# Altium schematic sheet 6PCB.SchDoc
size A4
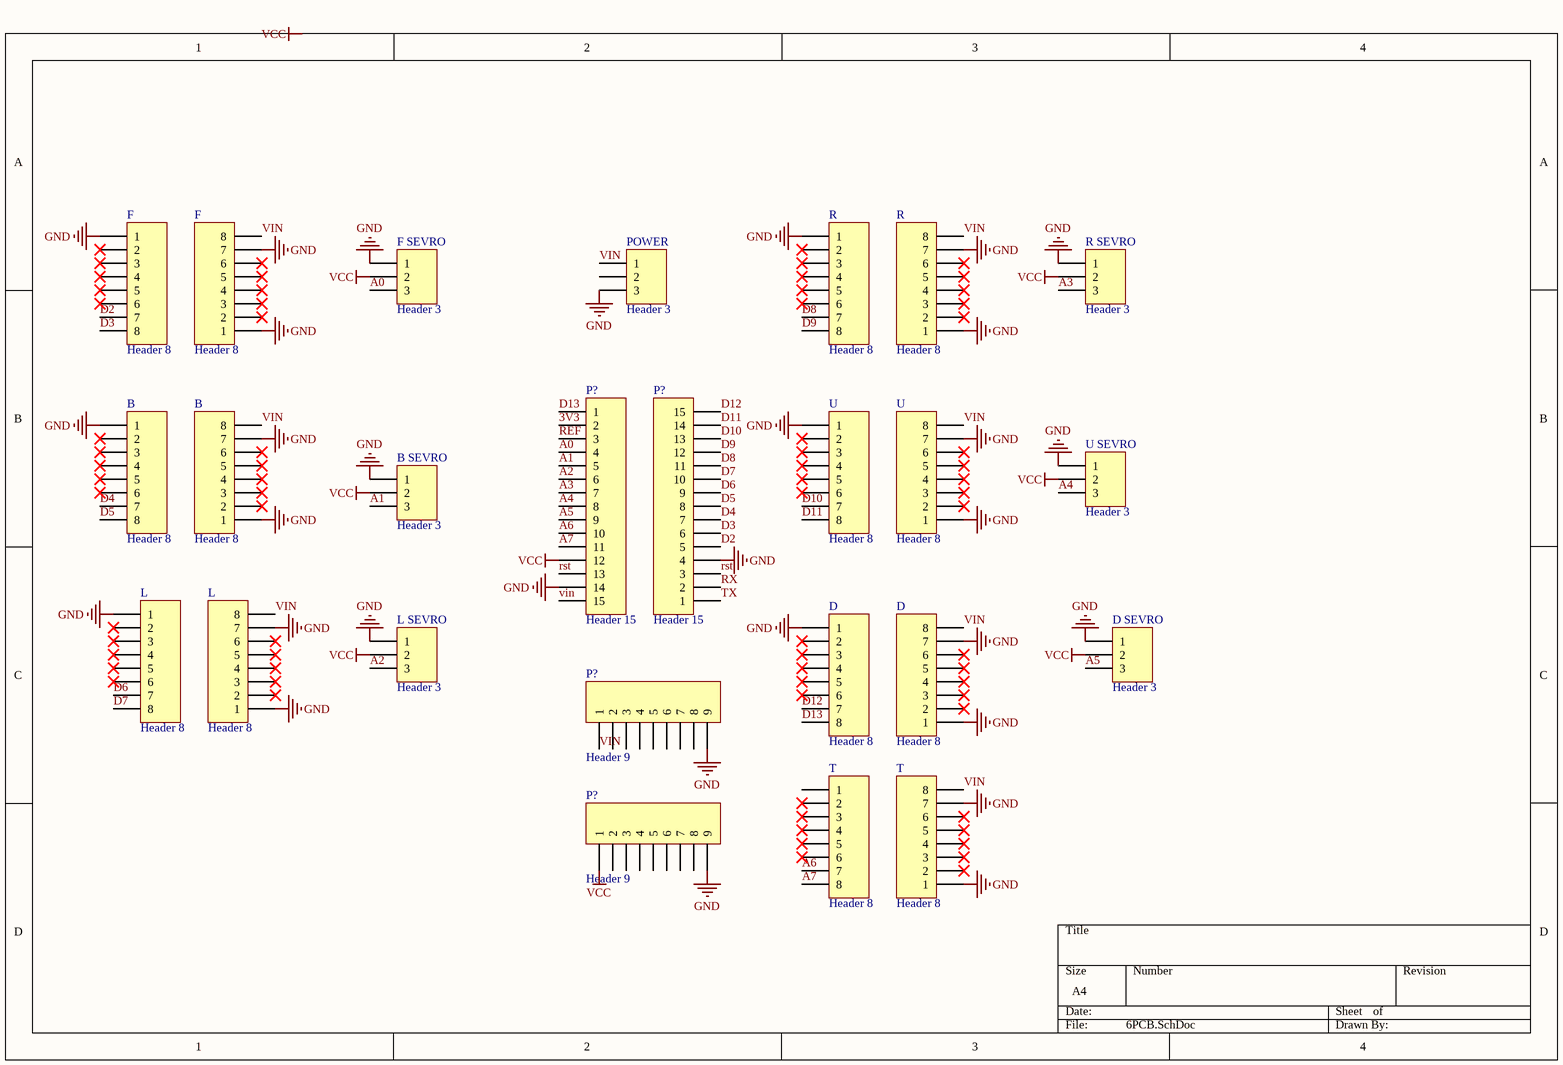
[diagram p0: 6PCB.SchDoc]

## Parts
(Parts that share a designator on the sheet are numbered #1, #2 ... from top to bottom, then left to right.)
B#1  Header 8  [HDR1X8]
B#2  Header 8  [HDR1X8]
B_SEVRO  Header 3  [HDR1X3]
D#1  Header 8  [HDR1X8]
D#2  Header 8  [HDR1X8]
D_SEVRO  Header 3  [HDR1X3]
F#1  Header 8  [HDR1X8]
F#2  Header 8  [HDR1X8]
F_SEVRO  Header 3  [HDR1X3]
L#1  Header 8  [HDR1X8]
L#2  Header 8  [HDR1X8]
L_SEVRO  Header 3  [HDR1X3]
P?#1  Header 15  [HDR1X15]
P?#2  Header 15  [HDR1X15]
P?#3  Header 9  [HDR1X9]
P?#4  Header 9  [HDR1X9]
POWER  Header 3  [HDR1X3]
R#1  Header 8  [HDR1X8]
R#2  Header 8  [HDR1X8]
R_SEVRO  Header 3  [HDR1X3]
T#1  Header 8  [HDR1X8]
T#2  Header 8  [HDR1X8]
U#1  Header 8  [HDR1X8]
U#2  Header 8  [HDR1X8]
U_SEVRO  Header 3  [HDR1X3]

## Nets
GND: B#1.1 B#2.1 B#2.7 B_SEVRO.1 D#1.1 D#2.1 D#2.7 D_SEVRO.1 F#1.1 F#2.1 F#2.7 F_SEVRO.1 L#1.1 L#2.1 L#2.7 L_SEVRO.1 P?#1.14 P?#2.4 P?#3.9 P?#4.9 POWER.3 R#1.1 R#2.1 R#2.7 R_SEVRO.1 T#2.1 T#2.7 U#1.1 U#2.1 U#2.7 U_SEVRO.1
VCC: B_SEVRO.2 D_SEVRO.2 F_SEVRO.2 L_SEVRO.2 P?#1.12 P?#4.1 R_SEVRO.2 U_SEVRO.2
3V3: P?#1.2
A0: F_SEVRO.3 P?#1.4
A1: B_SEVRO.3 P?#1.5
A2: L_SEVRO.3 P?#1.6
A3: P?#1.7 R_SEVRO.3
A4: P?#1.8 U_SEVRO.3
A5: D_SEVRO.3 P?#1.9
A6: P?#1.10 T#1.7
A7: P?#1.11 T#1.8
D2: F#1.7 P?#2.5
D3: F#1.8 P?#2.6
D4: B#1.7 P?#2.7
D5: B#1.8 P?#2.8
D6: L#1.7 P?#2.9
D7: L#1.8 P?#2.10
D8: P?#2.11 R#1.7
D9: P?#2.12 R#1.8
D10: P?#2.13 U#1.7
D11: P?#2.14 U#1.8
D12: D#1.7 P?#2.15
D13: D#1.8 P?#1.1
REF: P?#1.3
rst: P?#1.13 P?#2.3
RX: P?#2.2
TX: P?#2.1
vin: B#2.8 D#2.8 F#2.8 L#2.8 P?#1.15 P?#3.1 POWER.1 R#2.8 T#2.8 U#2.8

Not connected (* = marked no-connect by the designer): B#1 2* 3* 4* 5* 6*; B#2 2* 3* 4* 5* 6*; D#1 2* 3* 4* 5* 6*; D#2 2* 3* 4* 5* 6*; F#1 2* 3* 4* 5* 6*; F#2 2* 3* 4* 5* 6*; L#1 2* 3* 4* 5* 6*; L#2 2* 3* 4* 5* 6*; P?#3 2 3 4 5 6 7 8; P?#4 2 3 4 5 6 7 8; POWER 2; R#1 2* 3* 4* 5* 6*; R#2 2* 3* 4* 5* 6*; T#1 1 2* 3* 4* 5* 6*; T#2 2* 3* 4* 5* 6*; U#1 2* 3* 4* 5* 6*; U#2 2* 3* 4* 5* 6*

## Notes on the sheet
- Labels drawn without touching a wire or pin: VCC

## Library data of the parts
B#1 B#2 D#1 D#2 F#1 F#2 L#1 L#2 R#1 R#2 T#1 T#2 U#1 U#2 = Header 8: Header, 8-Pin; LatestRevisionDate: 17-Jul-2002; LatestRevisionNote: Re-released for DXP Platform.; Publisher: Altium Limited
B_SEVRO D_SEVRO F_SEVRO L_SEVRO POWER R_SEVRO U_SEVRO = Header 3: Header, 3-Pin; LatestRevisionDate: 17-Jul-2002; LatestRevisionNote: Re-released for DXP Platform.; Publisher: Altium Limited
P?#1 P?#2 = Header 15: Header, 15-Pin; LatestRevisionDate: 17-Jul-2002; LatestRevisionNote: Re-released for DXP Platform.; Publisher: Altium Limited
P?#3 P?#4 = Header 9: Header, 9-Pin; LatestRevisionDate: 17-Jul-2002; LatestRevisionNote: Re-released for DXP Platform.; Publisher: Altium Limited